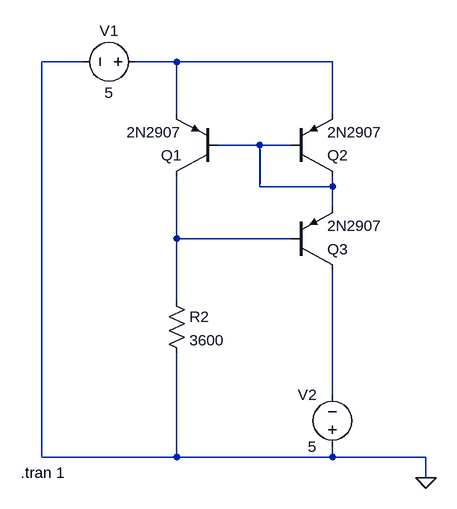
[diagram p0: schematic Draft6.asc]
Draft6.asc, the LTspice schematic file:
Version 4
SHEET 1 880 680
WIRE 128 16 64 16
WIRE 272 16 208 16
WIRE 512 16 272 16
WIRE 272 96 272 16
WIRE 512 96 512 16
WIRE 400 144 336 144
WIRE 448 144 400 144
WIRE 400 208 400 144
WIRE 512 208 512 192
WIRE 512 208 400 208
WIRE 512 240 512 208
WIRE 272 288 272 192
WIRE 448 288 272 288
WIRE 272 384 272 288
WIRE 512 528 512 336
WIRE 64 624 64 16
WIRE 272 624 272 464
WIRE 272 624 64 624
WIRE 512 624 512 608
WIRE 512 624 272 624
WIRE 656 624 512 624
WIRE 656 656 656 624
FLAG 656 656 0
SYMBOL voltage 224 16 R90
WINDOW 0 -32 56 VBottom 2
WINDOW 3 32 56 VTop 2
SYMATTR InstName V1
SYMATTR Value 5
SYMBOL pnp 336 192 R180
SYMATTR InstName Q1
SYMATTR Value 2N2907
SYMBOL pnp 448 192 M180
SYMATTR InstName Q2
SYMATTR Value 2N2907
SYMBOL pnp 448 336 M180
SYMATTR InstName Q3
SYMATTR Value 2N2907
SYMBOL res 256 368 R0
SYMATTR InstName R2
SYMATTR Value 3600
SYMBOL voltage 512 624 R180
WINDOW 0 24 96 Left 2
WINDOW 3 24 16 Left 2
SYMATTR InstName V2
SYMATTR Value 5
TEXT 32 648 Left 2 !.tran 1

The netlist it stands for:
* Draft6.asc
V1 N001 0 5
Q1 N003 N002 N001 0 2N2907
Q2 N002 N002 N001 0 2N2907
Q3 N004 N003 N002 0 2N2907
R2 N003 0 3600
V2 0 N004 5
.model NPN NPN
.model PNP PNP
.lib standard.bjt
.tran 1
.backanno
.end